# Altium schematic sheet Controller.SchDoc
size A4
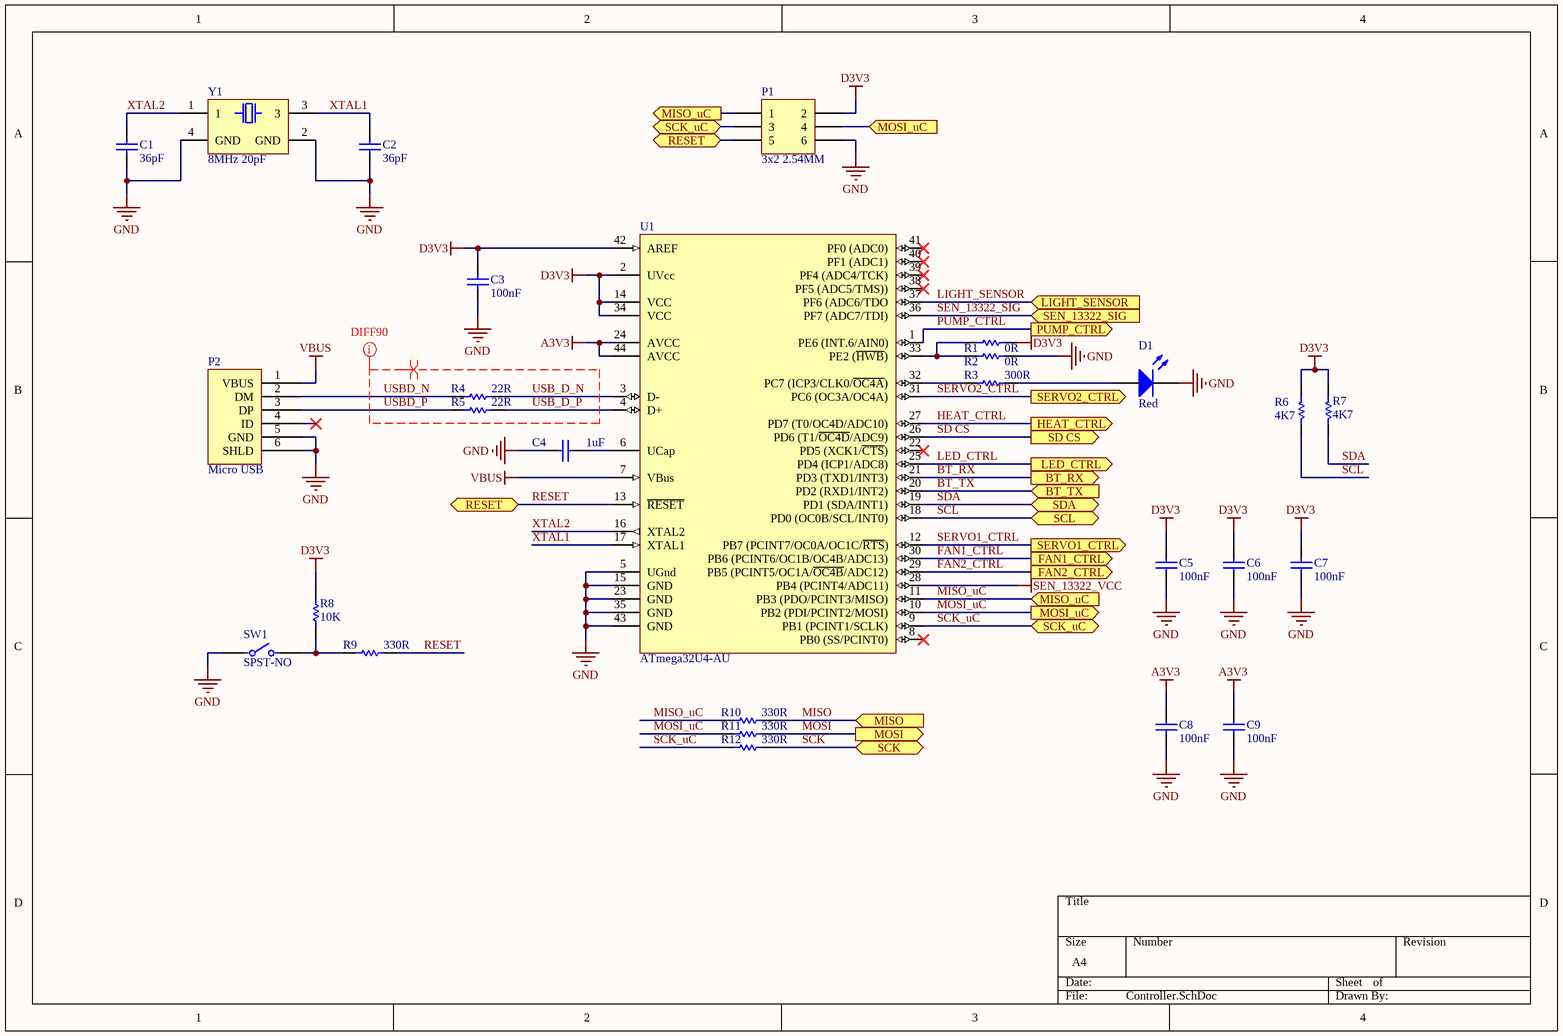
[diagram p0: Controller.SchDoc]

## Parts
C1  36pF  [CAP0603]
C2  36pF  [CAP0603]
C3  100nF  [CAP0603]
C4  1uF  [CAP0603]
C5  100nF  [CAP0603]
C6  100nF  [CAP0603]
C7  100nF  [CAP0603]
C8  100nF  [CAP0603]
C9  100nF  [CAP0603]
D1  Red  [DIODE0603]
P1  3x2 2.54MM  [HDR2X3]
P2  Micro USB  [MOLEX MICRO USB PORT]
R1  0R  [RES0603]
R2  0R  [RES0603]
R3  300R  [RES0603]
R4  22R  [RES0603]
R5  22R  [RES0603]
R6  4K7  [RES0603]
R7  4K7  [RES0603]
R8  10K  [RES0603]
R9  330R  [RES0603]
R10  330R  [RES0603]
R11  330R  [RES0603]
R12  330R  [RES0603]
SW1  SPST-NO  [Tactile SPST-NO Switch]
U1  ATmega32U4-AU  [44ML_M]
Y1  8MHz 20pF  [3225 XTAL]

## Ports
BT_RX (out), BT_TX (in), FAN1_CTRL (out), FAN2_CTRL (out), HEAT_CTRL (out), LED_CTRL (out), LIGHT_SENSOR (in), MISO (in), MISO_uC (in), MISO_uC (out), MOSI (out), MOSI_uC (in), MOSI_uC (out), PUMP_CTRL (out), RESET (bidir), SCK (bidir), SCK_uC (bidir), SCL (bidir), SD CS (out), SDA (bidir), SEN_13322_SIG (in), SERVO1_CTRL (out), SERVO2_CTRL (out)

## Nets
A3V3: C8.2 C9.2 U1.24(AVCC) U1.44(AVCC)
D3V3: C3.2 C5.2 C6.2 C7.2 P1.2 R1.2 R6.2 R7.2 R8.2 U1.2(UVcc) U1.14(VCC) U1.34(VCC) U1.42(AREF)
GND: C1.1 C2.1 C3.1 C4.1 C5.1 C6.1 C7.1 C8.1 C9.1 D1.2(K) P1.6 P2.5(GND) P2.6(SHLD) R2.2 SW1.1 U1.5(UGnd) U1.15(GND) U1.23(GND) U1.35(GND) U1.43(GND) Y1.2(GND) Y1.4(GND)
SEN_13322_VCC: U1.28(PB4_(PCINT4/ADC11))
VBUS: P2.1(VBUS) U1.7(VBus)
BT_RX: U1.21(PD3_(TXD1/INT3)) ; port BT_RX
BT_TX: U1.20(PD2_(RXD1/INT2)) ; port BT_TX
FAN1_CTRL: U1.30(PB6_(PCINT6/OC1B/OC4B/ADC13)) ; port FAN1_CTRL
FAN2_CTRL: U1.29(PB5_(PCINT5/OC1A/~{OC4B}/ADC12)) ; port FAN2_CTRL
HEAT_CTRL: U1.27(PD7_(T0/OC4D/ADC10)) ; port HEAT_CTRL
LED_CTRL: U1.25(PD4_(ICP1/ADC8)) ; port LED_CTRL
LIGHT_SENSOR: U1.37(PF6_(ADC6/TDO) ; port LIGHT_SENSOR
MISO: R10.1 ; port MISO
MISO_uC: P1.1 R10.2 U1.11(PB3_(PDO/PCINT3/MISO)) ; port MISO_uC
MOSI: R11.1 ; port MOSI
MOSI_uC: P1.4 R11.2 U1.10(PB2_(PDI/PCINT2/MOSI)) ; port MOSI_uC
PUMP_CTRL: U1.1(PE6_(INT.6/AIN0)) ; port PUMP_CTRL
RESET: P1.5 R9.1 U1.13(~{RESET}) ; port RESET
SCK: R12.1 ; port SCK
SCK_uC: P1.3 R12.2 U1.9(PB1_(PCINT1/SCLK)) ; port SCK_uC
SCL: R6.1 U1.18(PD0_(OC0B/SCL/INT0)) ; port SCL
SD CS: U1.26(PD6_(T1/~{OC4D}/ADC9)) ; port SD CS
SDA: R7.1 U1.19(PD1_(SDA/INT1)) ; port SDA
SEN_13322_SIG: U1.36(PF7_(ADC7/TDI)) ; port SEN_13322_SIG
SERVO1_CTRL: U1.12(PB7_(PCINT7/OC0A/OC1C/~{RTS})) ; port SERVO1_CTRL
SERVO2_CTRL: U1.31(PC6_(OC3A/OC4A)) ; port SERVO2_CTRL
USB_D_N: R4.2 U1.3(D-)
USB_D_P: R5.2 U1.4(D+)
USBD_N: P2.2(DM) R4.1
USBD_P: P2.3(DP) R5.1
XTAL1: C2.2 U1.17(XTAL1) Y1.3
XTAL2: C1.2 U1.16(XTAL2) Y1.1
NetC4_2: C4.2 U1.6(UCap)
NetD1_1: D1.1(A) R3.1
NetR1_1: R1.1 R2.1 U1.33(PE2_(~{HWB}))
NetR3_2: R3.2 U1.32(PC7_(ICP3/CLK0/~{OC4A}))
NetR8_1: R8.1 R9.2 SW1.2

Not connected (* = marked no-connect by the designer): P2 4(ID)*; U1 8(PB0_(SS/PCINT0))* 22(PD5_(XCK1/~{CTS}))* 38(PF5_(ADC5/TMS)))* 39(PF4_(ADC4/TCK))* 40(PF1_(ADC1))* 41(PF0_(ADC0))*

## Layout directives
differential pair: USB_D_N, USB_D_P, USBD_N, USBD_P
net class USB: USB_D_N, USB_D_P, USBD_N, USBD_P

## Library data of the parts
C1-C9 = Capacitor: Published: 8-Jun-2000; LatestRevisionDate: 17-Jul-2002; LatestRevisionNote: Re-released for DXP Platform.; PackageReference: RAD-0.3; Publisher: Altium Limited; PackageDescription: Radial Cap, Thru-Hole; 2 Leads; 0.3 in Pin Spacing; Value: Value
D1 = LED: Light Emitting Diode; Published: 8-Jun-2000; LatestRevisionDate: 17-Jul-2002; LatestRevisionNote: Re-released for DXP Platform.; PackageVersion: Sep-1996; PackageReference: SMC; Publisher: Altium Limited; PackageDescription: DO-214-AB/SMC; 2 C-Bend Leads; Body 7.9 x 5.9 mm, inc. leads (LxW); Code_JEDEC: DO-214-AB
P1 = 3x2 2.54MM: Header, 3-Pin, Dual row; LatestRevisionDate: 17-Jul-2002; LatestRevisionNote: Re-released for DXP Platform.; Publisher: Altium Limited
P2 = Micro USB Connector
R1-R12 = Resistor: Published: 8-Jun-2000; LatestRevisionDate: 17-Jul-2002; LatestRevisionNote: Re-released for DXP Platform.; PackageReference: AXIAL-0.3; Publisher: Altium Limited; PackageDescription: Axial Device, Thru-Hole; 2 Leads; 0.3 in Pin Spacing; Value: Value
SW1 = B3U-1000P-B: SPST-NO Switch SMD; Manufacturer: Omron; Operating Force: 1.5N; Voltage Rating Dc: 12V; Contact Current Rating: 50mA; Contact Resistance: 100mΩ; Electromechanical Life: 200000Cycles; Height: 1.75mm; Device Class L2: Switches; Temperature Range High: +70°C; Digikey Description: SWITCH TACTILE SPST-NO 0.05A 12V; Throw Configuration: SPST-NO; Ambient Temperature Range High: +70°C; Temperature: -25°C to +70°C; Lead Free: Yes; ComponentLink2URL: https://omronfs.omron.com/en_US/ecb/products/pdf/en-b3u.pdf; Device Class L3: Tactile Switches; Manufacturer Part Number: B3U-1000P-B; Ambient Temperature Range Low: -25°C; Mount: Surface Mount; Automotive: No; Mouser Description: Tactile Switches Top Actuated with boss w/o ground; Octopart: https://octopart.com/b3u-1000p-b-omron-1057356; RoHS: TRUE; Package: 0; Device Class L1: Electromechanical; Category: Switch; Temperature Range Low: -25°C; ComponentLink2Description: Datasheet
U1 = CMP-0095-00285-2: 8-bit AVR Microcontroller, 2.7-5.5V, 16MHz, 32KB Flash, 1KB EEPROM, 2.5KB SRAM, USB Controller, 44-pin TQFP, Industrial Grade (-40°C to 85°C), Ext Osc; RevisionNote: DatasheetVersion updated. URLs added.; ComponentLink1Description: Manufacturer URL; PackageDescription: 44-Pin Plastic Thin Quad Flat Pack, 10 x 10 x 1.0 mm Body, 0.8 mm Pitch (TQFP); DatasheetVersion: revF, Nov-2010; ComponentLink2URL: http://www.atmel.com/dyn/resources/prod_documents/doc7766.pdf; ComponentLink1URL: http://www.atmel.com/; PackageReference: 44ML; ComponentLink2Description: ATmega16U4/32U4 Datasheet; PackageVersion: rev.G, Jul-2007; ComponentLink3URL: http://www.atmel.com/dyn/resources/prod_documents/7766S.pdf; ComponentLink3Description: ATmega16U4 ATmega32U4 Summary
Y1 = XTAL: 3225 XTAL; MP: TSX-3225 16.0000MF18X-AC3; MF: EPSON; Availability: Unavailable; Package: SMD-4 Epson; SnapEDA_Link: https://www.snapeda.com/parts/TSX-3225%2016.0000MF18X-AC3/EPSON/view-part/105674/?ref=snap; Value: *; Price: None